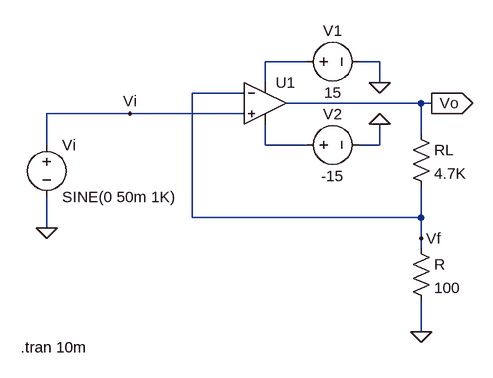
[diagram p0: schematic Run 3_A.asc]
Run 3_A.asc, the LTspice schematic file:
Version 4
SHEET 1 880 680
WIRE 592 208 528 208
WIRE 704 208 672 208
WIRE 528 240 528 208
WIRE 704 240 704 208
WIRE 496 256 416 256
WIRE 768 272 560 272
WIRE 784 272 768 272
WIRE 320 288 192 288
WIRE 496 288 320 288
WIRE 768 320 768 272
WIRE 192 336 192 288
WIRE 528 336 528 304
WIRE 592 336 528 336
WIRE 704 336 704 304
WIRE 704 336 672 336
WIRE 416 448 416 256
WIRE 768 448 768 400
WIRE 768 448 416 448
WIRE 192 464 192 416
WIRE 768 480 768 448
WIRE 768 496 768 480
WIRE 768 624 768 576
FLAG 704 240 0
FLAG 704 304 0
FLAG 768 624 0
FLAG 192 464 0
FLAG 784 272 Vo
IOPIN 784 272 Out
FLAG 768 480 Vf
FLAG 320 288 Vi
SYMBOL OpAmps\\UniversalOpamp2 528 272 R0
SYMATTR InstName U1
SYMBOL voltage 576 208 R270
WINDOW 0 32 56 VTop 2
WINDOW 3 -32 56 VBottom 2
WINDOW 123 0 0 Left 0
WINDOW 39 0 0 Left 0
SYMATTR InstName V1
SYMATTR Value 15
SYMBOL voltage 576 336 R270
WINDOW 0 32 56 VTop 2
WINDOW 3 -32 56 VBottom 2
WINDOW 123 0 0 Left 0
WINDOW 39 0 0 Left 0
SYMATTR InstName V2
SYMATTR Value -15
SYMBOL res 752 304 R0
SYMATTR InstName RL
SYMATTR Value 4.7K
SYMBOL res 752 480 R0
SYMATTR InstName R
SYMATTR Value 100
SYMBOL voltage 192 320 R0
WINDOW 123 0 0 Left 0
WINDOW 39 0 0 Left 0
SYMATTR InstName Vi
SYMATTR Value SINE(0 50m 1K)
TEXT 152 648 Left 2 !.tran 10m

The netlist it stands for:
* Run 3_A.asc
XU1 Vi Vf N001 N002 Vo level.2 Avol=1Meg GBW=10Meg Slew=10Meg ilimit=25m rail=0 Vos=0 phimargin=45 en=0 enk=0 in=0 ink=0 Rin=500Meg  ; pins IN+ IN- V+ V- OUT
V1 N001 0 15
V2 N002 0 -15
RL Vo Vf 4.7K
R Vf 0 100
Vi Vi 0 SINE(0 50m 1K)
.tran 10m
.lib UniversalOpamps2.sub
.backanno
.end